# EasyEDA schematic SCH_LAIRR-Schematics_2026-06-09.json
TITLE: LAIRR_Schematic_v1; REV: 1.0; Date: 2026-06-06; Sheet: 1/1; Drawn By: Electrical Team; Company: LAIRR 2026
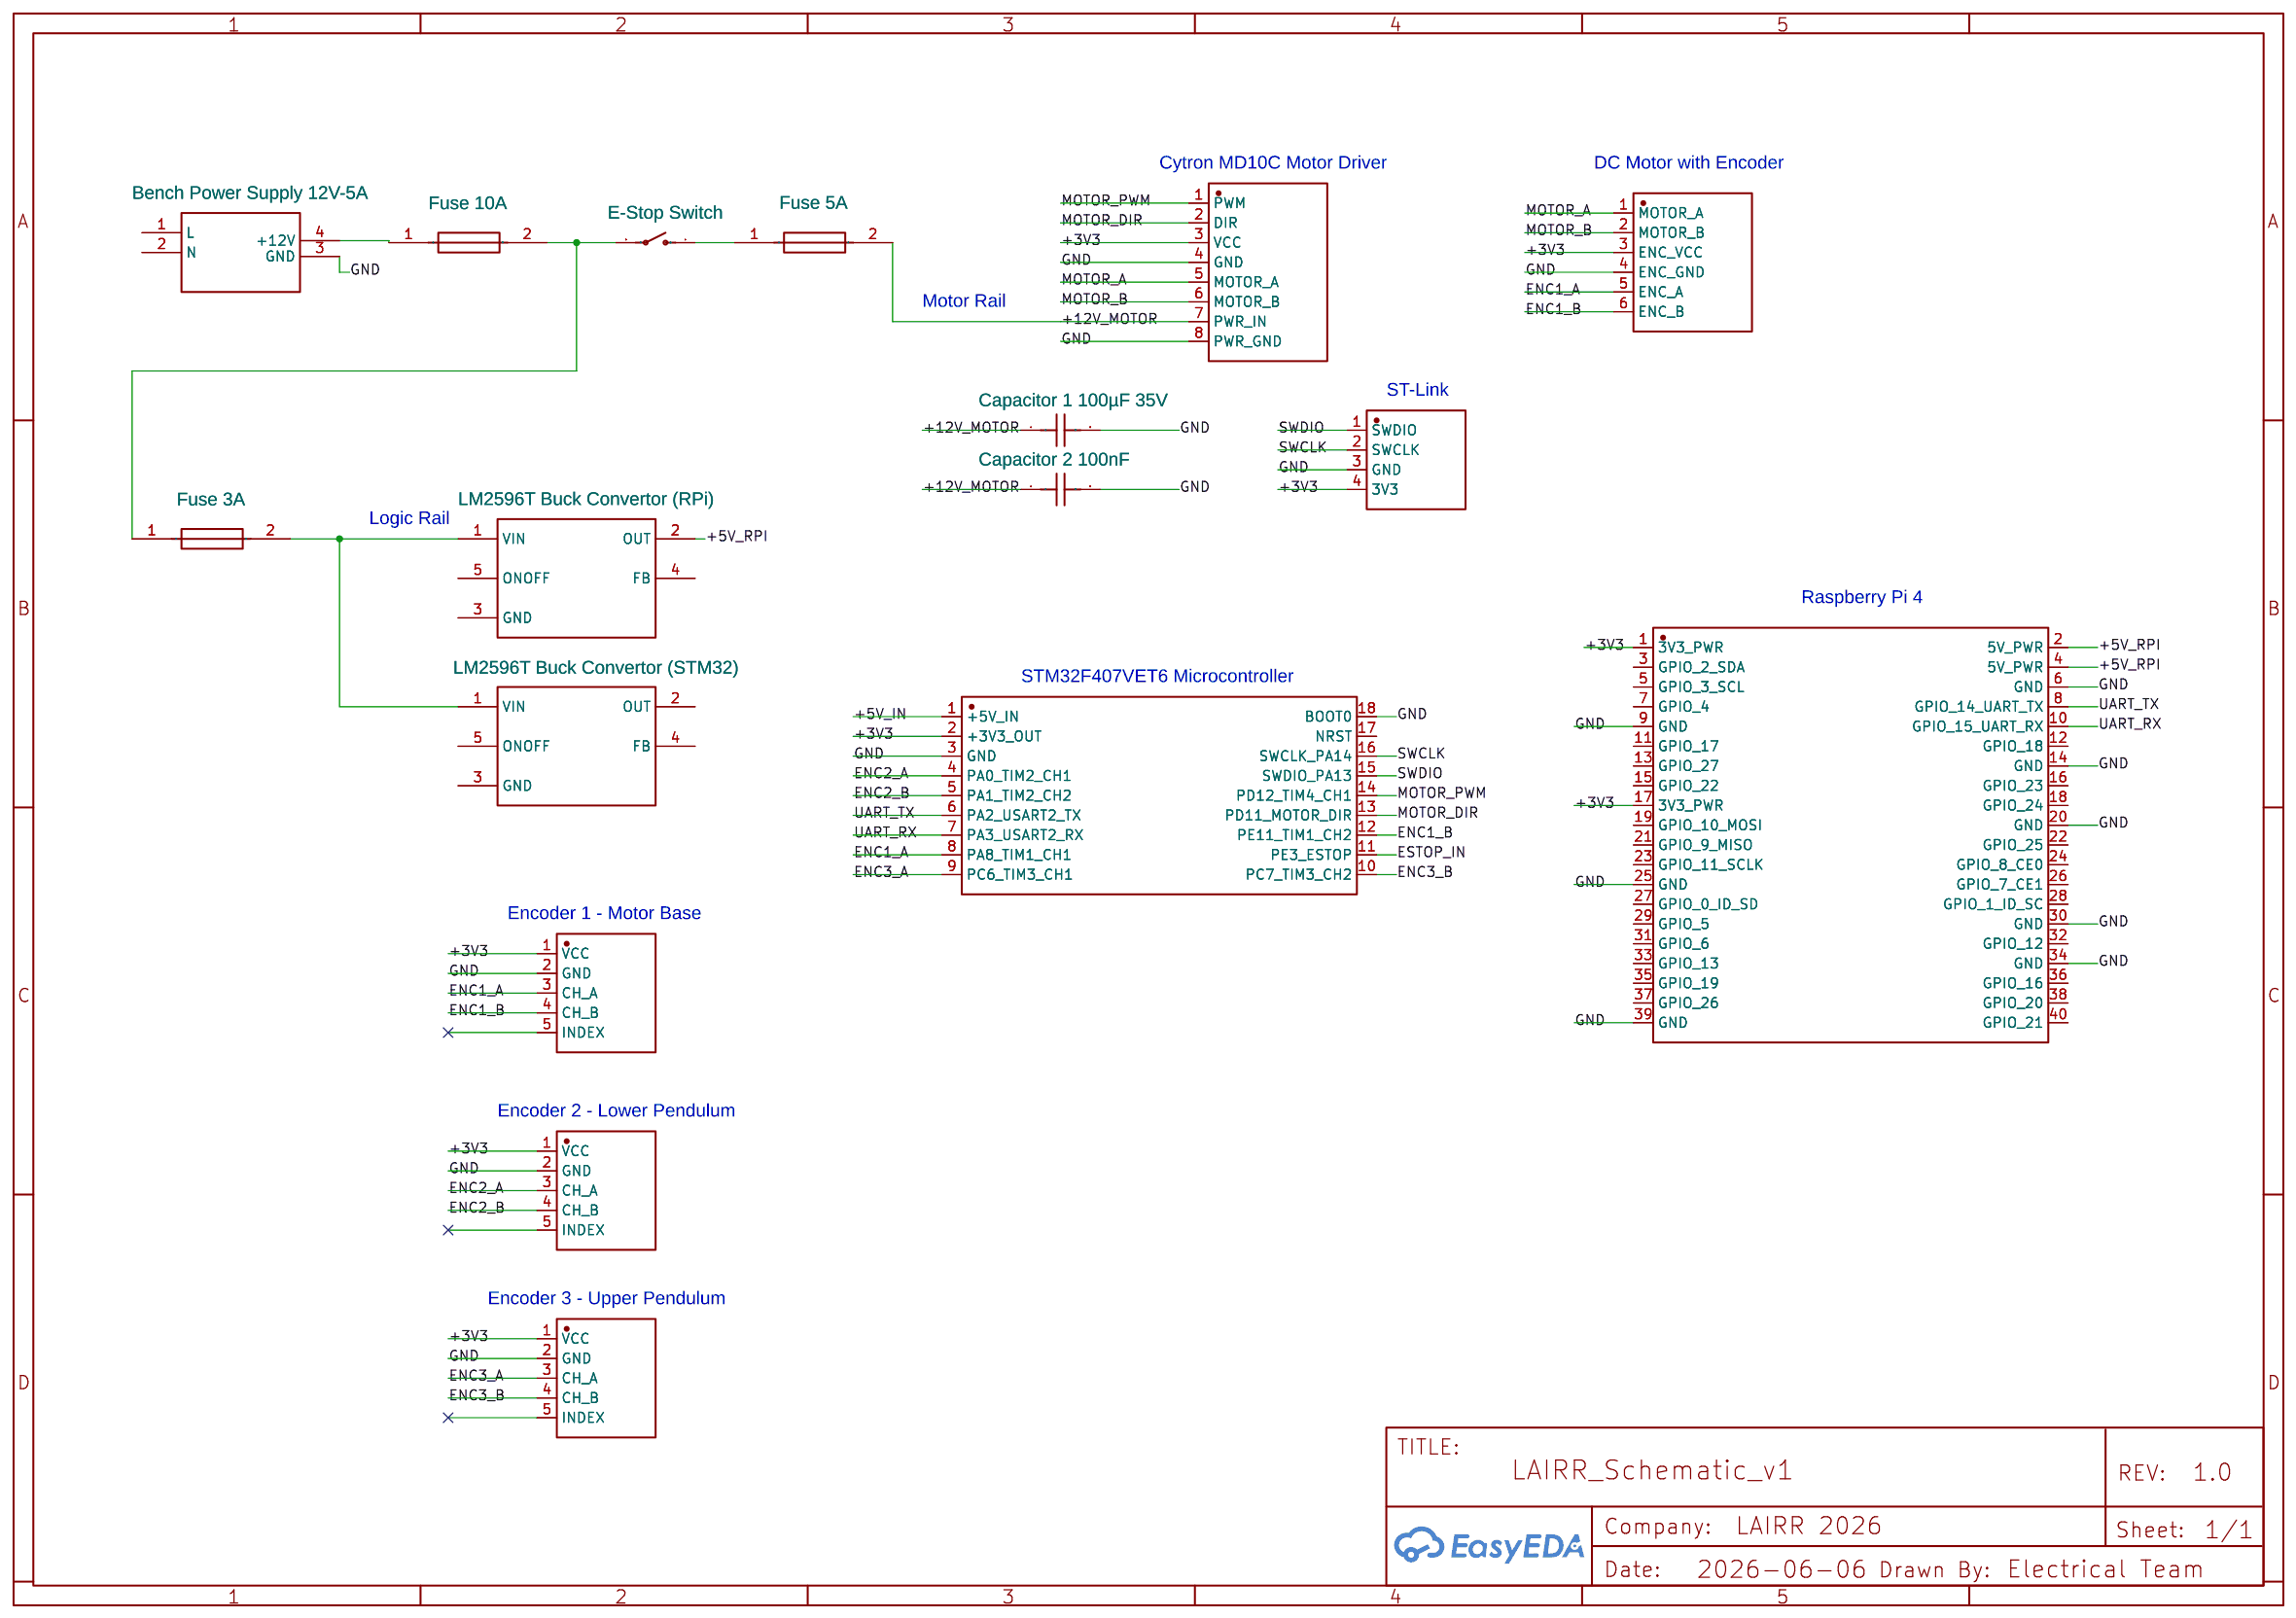
[diagram p0: schematic sheet]

## Parts
C1  Capacitor 1 100µF 35V  [CAP-TH_L5.5-W3.2-P5.00-D1.0]
C2  Capacitor 2 100nF  [CAP-TH_L5.5-W3.2-P5.00-D1.0]
D  NO
PWR1  Bench Power Supply 12V-5A  [SWITCHING POWER SUPPLY 12V 2A ISOLATED POWER SUPPLY]
U1  Fuse 10A  [FUSE-TH_AUTO-FUSE-3A]
U2  Fuse 5A  [FUSE-TH_AUTO-FUSE-3A]
U3  Fuse 3A  [FUSE-TH_AUTO-FUSE-3A]
U4  E-Stop Switch  [SWITCH-SPST-VERTICAL]
U5  LM2596T Buck Convertor (RPi)  [T05D]
U6  LM2596T Buck Convertor (STM32)  [T05D]
U7  NO
U8  NO
U9  NO
U10  NO
U11  NO
U12  NO
U13  NO

## Library data of the parts
C1 C2 = 101K/1KV Capacitor: Supplier: LCSC; Manufacturer: ReliaPro; Supplier Part: C3715; JLCPCB Part Class: Extended Part
PWR1 = power-supply-12v-2a: Supplier: Aliexpress; link: https://www.aliexpress.com/item/1005001696853037.html?spm=a2g0o.cart.0.0.50c83c00KjxXgi&mp=1; Contributor: ariomelsandy
U1-U3 = FUSEE: Supplier: LCSC; Supplier Part: C9900014676; Manufacturer: null; Manufacturer Part: 汽车中号保险丝座; Contributor: huda22; JLCPCB Part Class: Extended Part
U4 = SWITCH-SPST-2TV: Contributor: SparkFun
U5 U6 = LM2596T-12NOPB: SIMPLE SWITCHER?Power Converter 150 KHz 3A Step-Down Voltage Regulator, 5-pin TO-220, Pb-Free

## Nets
+3V3: D.3(VCC) U7.3(ENC_VCC) U8.1(3V3_PWR) U8.17(3V3_PWR) U9.1(VCC) U10.1(VCC) U11.2(+3V3_OUT) U12.1(VCC) U13.4(3V3)
+5V_IN: U11.1(+5V_IN)
+5V_RPI: U5.2(OUT) U8.2(5V_PWR) U8.4(5V_PWR)
+12V_MOTOR: C1.1 C2.1 D.7(PWR_IN) U2.2
GND: C1.2 C2.2 D.4(GND) D.8(PWR_GND) PWR1.3(GND) U7.4(ENC_GND) U8.6(GND) U8.9(GND) U8.14(GND) U8.20(GND) U8.25(GND) U8.30(GND) U8.34(GND) U8.39(GND) U9.2(GND) U10.2(GND) U11.3(GND) U11.18(BOOT0) U12.2(GND) U13.3(GND)
ENC1_A: U7.5(ENC_A) U9.3(CH_A) U11.8(PA8_TIM1_CH1)
ENC1_B: U7.6(ENC_B) U9.4(CH_B) U11.12(PE11_TIM1_CH2)
ENC2_A: U10.3(CH_A) U11.4(PA0_TIM2_CH1)
ENC2_B: U10.4(CH_B) U11.5(PA1_TIM2_CH2)
ENC3_A: U11.9(PC6_TIM3_CH1) U12.3(CH_A)
ENC3_B: U11.10(PC7_TIM3_CH2) U12.4(CH_B)
ESTOP_IN: U11.11(PE3_ESTOP)
MOTOR_A: D.5(MOTOR_A) U7.1(MOTOR_A)
MOTOR_B: D.6(MOTOR_B) U7.2(MOTOR_B)
MOTOR_DIR: D.2(DIR) U11.13(PD11_MOTOR_DIR)
MOTOR_PWM: D.1(PWM) U11.14(PD12_TIM4_CH1)
SWCLK: U11.16(SWCLK_PA14) U13.2(SWCLK)
SWDIO: U11.15(SWDIO_PA13) U13.1(SWDIO)
UART_RX: U8.10(GPIO 15_UART_RX) U11.7(PA3_USART2_RX)
UART_TX: U8.8(GPIO 14_UART_TX) U11.6(PA2_USART2_TX)
Net-(PWR1-4): PWR1.4(+12V) U1.1
Net-(U1-2): U1.2 U3.1 U4.2(P)
Net-(U2-1): U2.1 U4.1(O)
Net-(U3-2): U3.2 U5.1(VIN) U6.1(VIN)

Not connected (* = marked no-connect by the designer): PWR1 1(L) 2(N); U5 3(GND) 4(FB) 5(ONOFF); U6 2(OUT) 3(GND) 4(FB) 5(ONOFF); U8 3(GPIO 2_SDA) 5(GPIO 3_SCL) 7(GPIO 4) 11(GPIO 17) 12(GPIO 18) 13(GPIO 27) 15(GPIO 22) 16(GPIO 23) 18(GPIO 24) 19(GPIO 10_MOSI) 21(GPIO 9_MISO) 22(GPIO 25) 23(GPIO 11_SCLK) 24(GPIO 8_CE0) 26(GPIO 7_CE1) 27(GPIO 0_ID_SD) 28(GPIO 1_ID_SC) 29(GPIO 5) 31(GPIO 6) 32(GPIO 12) 33(GPIO 13) 35(GPIO 19) 36(GPIO 16) 37(GPIO 26) 38(GPIO 20) 40(GPIO 21); U9 5(INDEX); U10 5(INDEX); U11 17(NRST); U12 5(INDEX)

## Notes on the sheet
- Cytron MD10C Motor Driver
- DC Motor with Encoder
- Motor Rail
- ST-Link
- Logic Rail
- Raspberry Pi 4
- STM32F407VET6 Microcontroller
- Encoder 1 - Motor Base
- Encoder 2 - Lower Pendulum
- Encoder 3 - Upper Pendulum
